# Altium schematic sheet ADCs.SchDoc: ADCs
size Letter; Date: 2017-01-08; DocumentNumber: 4; Revision: A; SheetNumber: 4; SheetTotal: 7; ProjectTitle: SDRdrum Arty Shield; PageSetup: Record=PageOptions|CenterHorizontal=True|CenterVertical=True|PrintScale=0.98|XCorrection=1.00|YCorrection=1.00|PrintKind=2|BorderSize=5000000|LeftOffset=0|BottomOffset=0|Orientation=2|PaperLength=1000|PaperWidth=1000|Scale=100|PaperSource=7|PrintQuality=-3|MediaType=1|DitherType=10|PrintScaleMode=1|PaperKind=Tabloid|PaperIndex=3
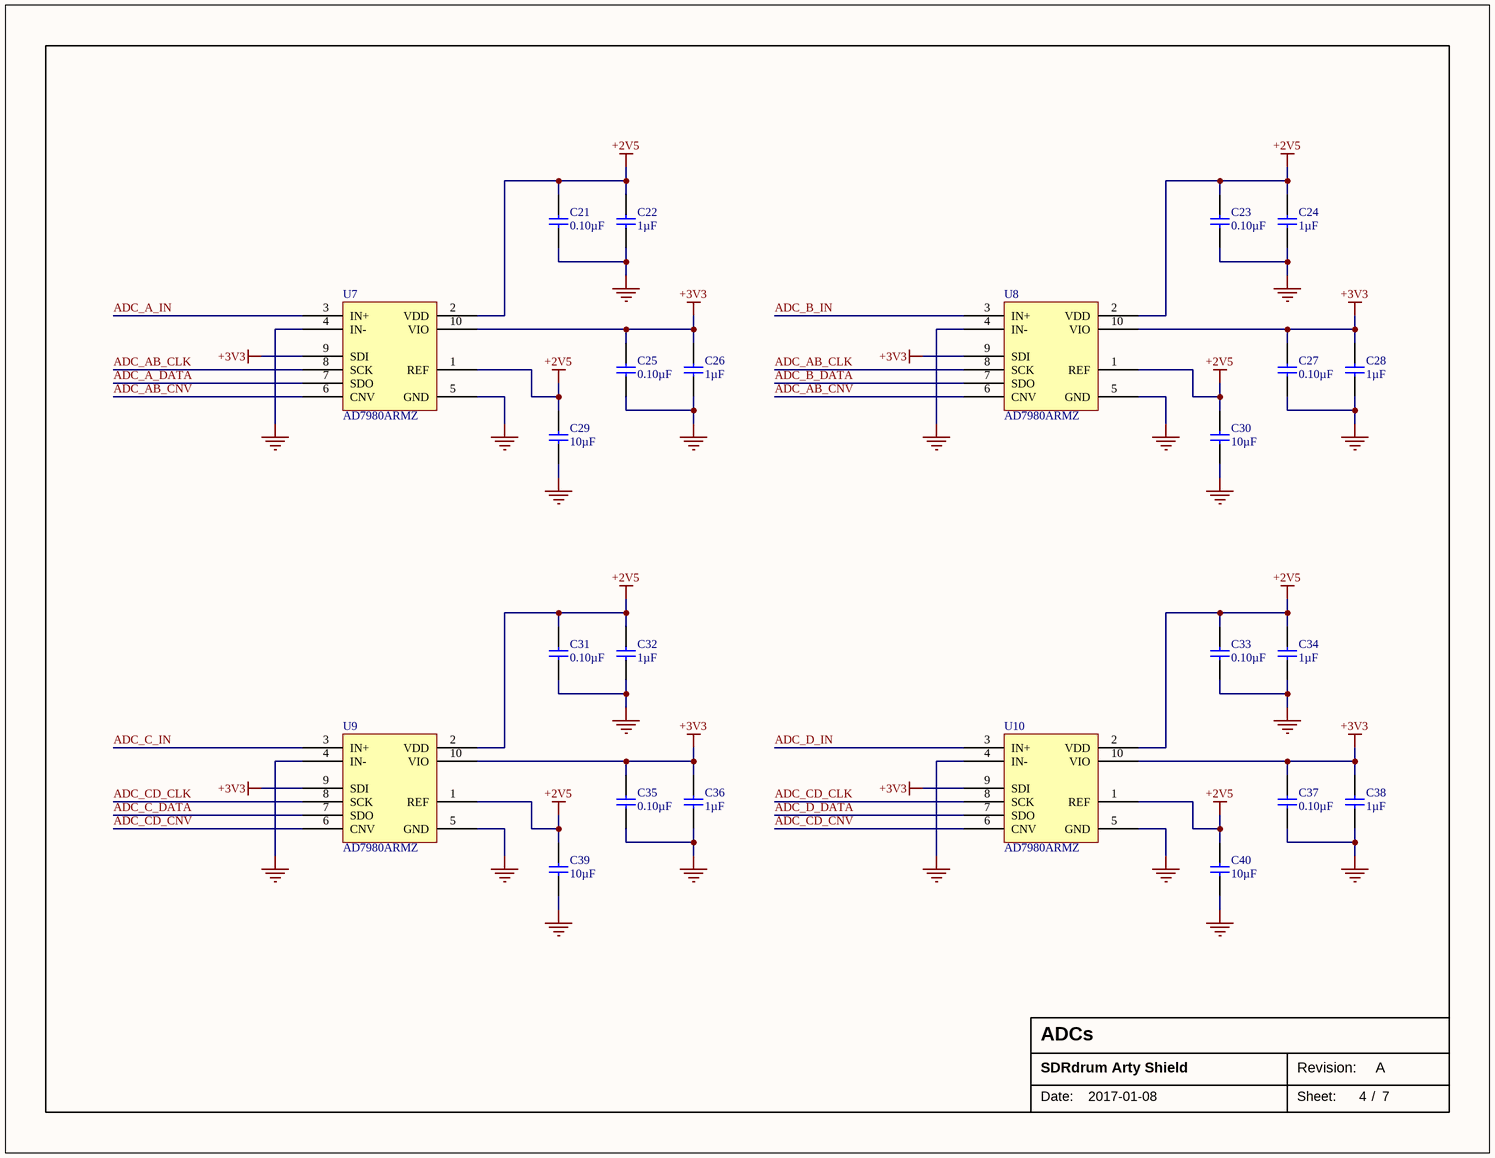
[diagram p0: ADCs.SchDoc]

## Parts
C21  value 0.10µF  [CAP-0402-M]  (hidden comment: Capacitor)
C22  value 1µF  [CAP-0402-M]  (hidden comment: Capacitor)
C23  value 0.10µF  [CAP-0402-M]  (hidden comment: Capacitor)
C24  value 1µF  [CAP-0402-M]  (hidden comment: Capacitor)
C25  value 0.10µF  [CAP-0402-M]  (hidden comment: Capacitor)
C26  value 1µF  [CAP-0402-M]  (hidden comment: Capacitor)
C27  value 0.10µF  [CAP-0402-M]  (hidden comment: Capacitor)
C28  value 1µF  [CAP-0402-M]  (hidden comment: Capacitor)
C29  value 10µF  [CAP-0805-M]  (hidden comment: Capacitor)
C30  value 10µF  [CAP-0805-M]  (hidden comment: Capacitor)
C31  value 0.10µF  [CAP-0402-M]  (hidden comment: Capacitor)
C32  value 1µF  [CAP-0402-M]  (hidden comment: Capacitor)
C33  value 0.10µF  [CAP-0402-M]  (hidden comment: Capacitor)
C34  value 1µF  [CAP-0402-M]  (hidden comment: Capacitor)
C35  value 0.10µF  [CAP-0402-M]  (hidden comment: Capacitor)
C36  value 1µF  [CAP-0402-M]  (hidden comment: Capacitor)
C37  value 0.10µF  [CAP-0402-M]  (hidden comment: Capacitor)
C38  value 1µF  [CAP-0402-M]  (hidden comment: Capacitor)
C39  value 10µF  [CAP-0805-M]  (hidden comment: Capacitor)
C40  value 10µF  [CAP-0805-M]  (hidden comment: Capacitor)
U7  AD7980ARMZ  [TSSOP50P490X110-10N]
U8  AD7980ARMZ  [TSSOP50P490X110-10N]
U9  AD7980ARMZ  [TSSOP50P490X110-10N]
U10  AD7980ARMZ  [TSSOP50P490X110-10N]

## Nets
+2V5: C21.1 C22.1 C23.1 C24.1 C29.2 C30.2 C31.1 C32.1 C33.1 C34.1 C39.2 C40.2 U7.1(REF) U7.2(VDD) U8.1(REF) U8.2(VDD) U9.1(REF) U9.2(VDD) U10.1(REF) U10.2(VDD)
+3V3: C25.1 C26.1 C27.1 C28.1 C35.1 C36.1 C37.1 C38.1 U7.9(SDI) U7.10(VIO) U8.9(SDI) U8.10(VIO) U9.9(SDI) U9.10(VIO) U10.9(SDI) U10.10(VIO)
GND: C21.2 C22.2 C23.2 C24.2 C25.2 C26.2 C27.2 C28.2 C29.1 C30.1 C31.2 C32.2 C33.2 C34.2 C35.2 C36.2 C37.2 C38.2 C39.1 C40.1 U7.4(IN-) U7.5(GND) U8.4(IN-) U8.5(GND) U9.4(IN-) U9.5(GND) U10.4(IN-) U10.5(GND)
ADC_A_DATA: U7.7(SDO)
ADC_A_IN: U7.3(IN+)
ADC_AB_CLK: U7.8(SCK) U8.8(SCK)
ADC_AB_CNV: U7.6(CNV) U8.6(CNV)
ADC_B_DATA: U8.7(SDO)
ADC_B_IN: U8.3(IN+)
ADC_C_DATA: U9.7(SDO)
ADC_C_IN: U9.3(IN+)
ADC_CD_CLK: U9.8(SCK) U10.8(SCK)
ADC_CD_CNV: U9.6(CNV) U10.6(CNV)
ADC_D_DATA: U10.7(SDO)
ADC_D_IN: U10.3(IN+)

## Notes on the sheet
- Date:
- Revision:
- Sheet:
- /

## Library data of the parts
C21 C23 C25 C27 C31 C33 C35 C37 = CC0402KRX5R6BB104: Manufacturer: Yageo; Manufacturer Series: CC; Tolerance: ±10%; Voltage: 10V; Temperature Coefficient: X5R; Part Number: CC0402KRX5R6BB104; Component Type: Standard; Package: 0402; Temperature Range: -55°C ~ 85°C; Supplier 1: Digi-Key; Supplier Part Number 1: 311-1336-1-ND
C22 C24 C26 C28 C32 C34 C36 C38 = CC0402KRX5R6BB105: Manufacturer: Yageo; Manufacturer Series: CC; Tolerance: ±10%; Voltage: 10V; Temperature Coefficient: X5R; Part Number: CC0402KRX5R6BB105; Component Type: Standard; Package: 0402; Temperature Range: -55°C ~ 85°C; Supplier 1: Digi-Key; Supplier Part Number 1: 311-1439-1-ND
C29 C30 C39 C40 = CC0805KKX5R6BB106: Manufacturer: Yageo; Manufacturer Series: CC; Tolerance: ±10%; Voltage: 10V; Temperature Coefficient: X5R; Part Number: CC0805KKX5R6BB106; Component Type: Standard; Package: 0805; Temperature Range: -55°C ~ 85°C; Supplier 1: Digi-Key; Supplier Part Number 1: 311-1460-1-ND